# EAGLE design OSER_RFID_RFIDHub (EAGLE 9.4.2)
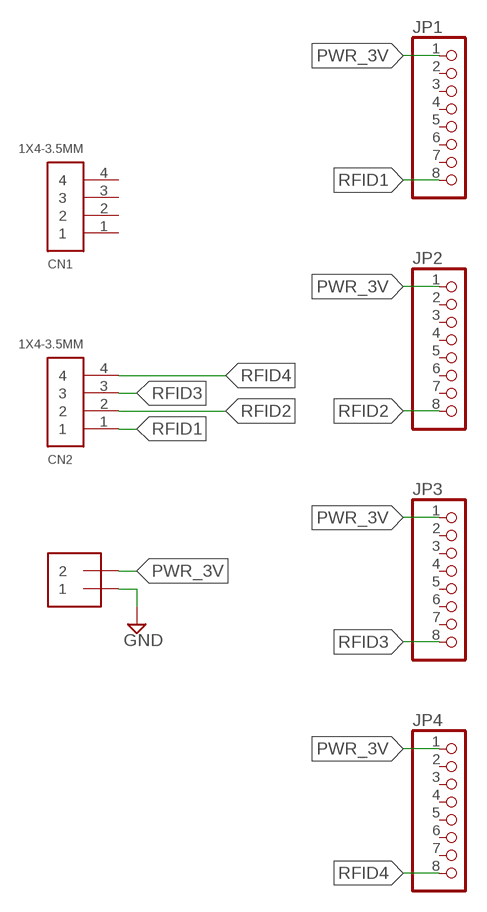
[diagram p0: schematic, sheet 1]

## Parts
CN1  1X4-3.5MM  [1X04-3.5MM]
CN2  1X4-3.5MM  [1X04-3.5MM]
J1  1X2-3.5MM  [1X2-3.5MM]
JP1  PINHD-1X8BIG  [1X08-BIG]
JP2  PINHD-1X8BIG  [1X08-BIG]
JP3  PINHD-1X8BIG  [1X08-BIG]
JP4  PINHD-1X8BIG  [1X08-BIG]

## Nets
GND: J1.1
PWR_3V: J1.2 JP1.1 JP2.1 JP3.1 JP4.1
RFID1: CN2.1 JP1.8
RFID2: CN2.2 JP2.8
RFID3: CN2.3 JP3.8
RFID4: CN2.4 JP4.8
Unconnected: CN1.1 CN1.2 CN1.3 CN1.4 JP1.2 JP1.3 JP1.4 JP1.5 JP1.6 JP1.7 JP2.2 JP2.3 JP2.4 JP2.5 JP2.6 JP2.7 JP3.2 JP3.3 JP3.4 JP3.5 JP3.6 JP3.7 JP4.2 JP4.3 JP4.4 JP4.5 JP4.6 JP4.7

## Library data of the parts
CN1 CN2 = adafruit:1X4: 4-pin connector
J1 = adafruit:1X2: 3.5mm Terminal block http://www.ladyada.net/library/pcb/eaglelibrary.html
JP1-JP4 = adafruit:PINHD-1X8: PIN HEADER

## Board
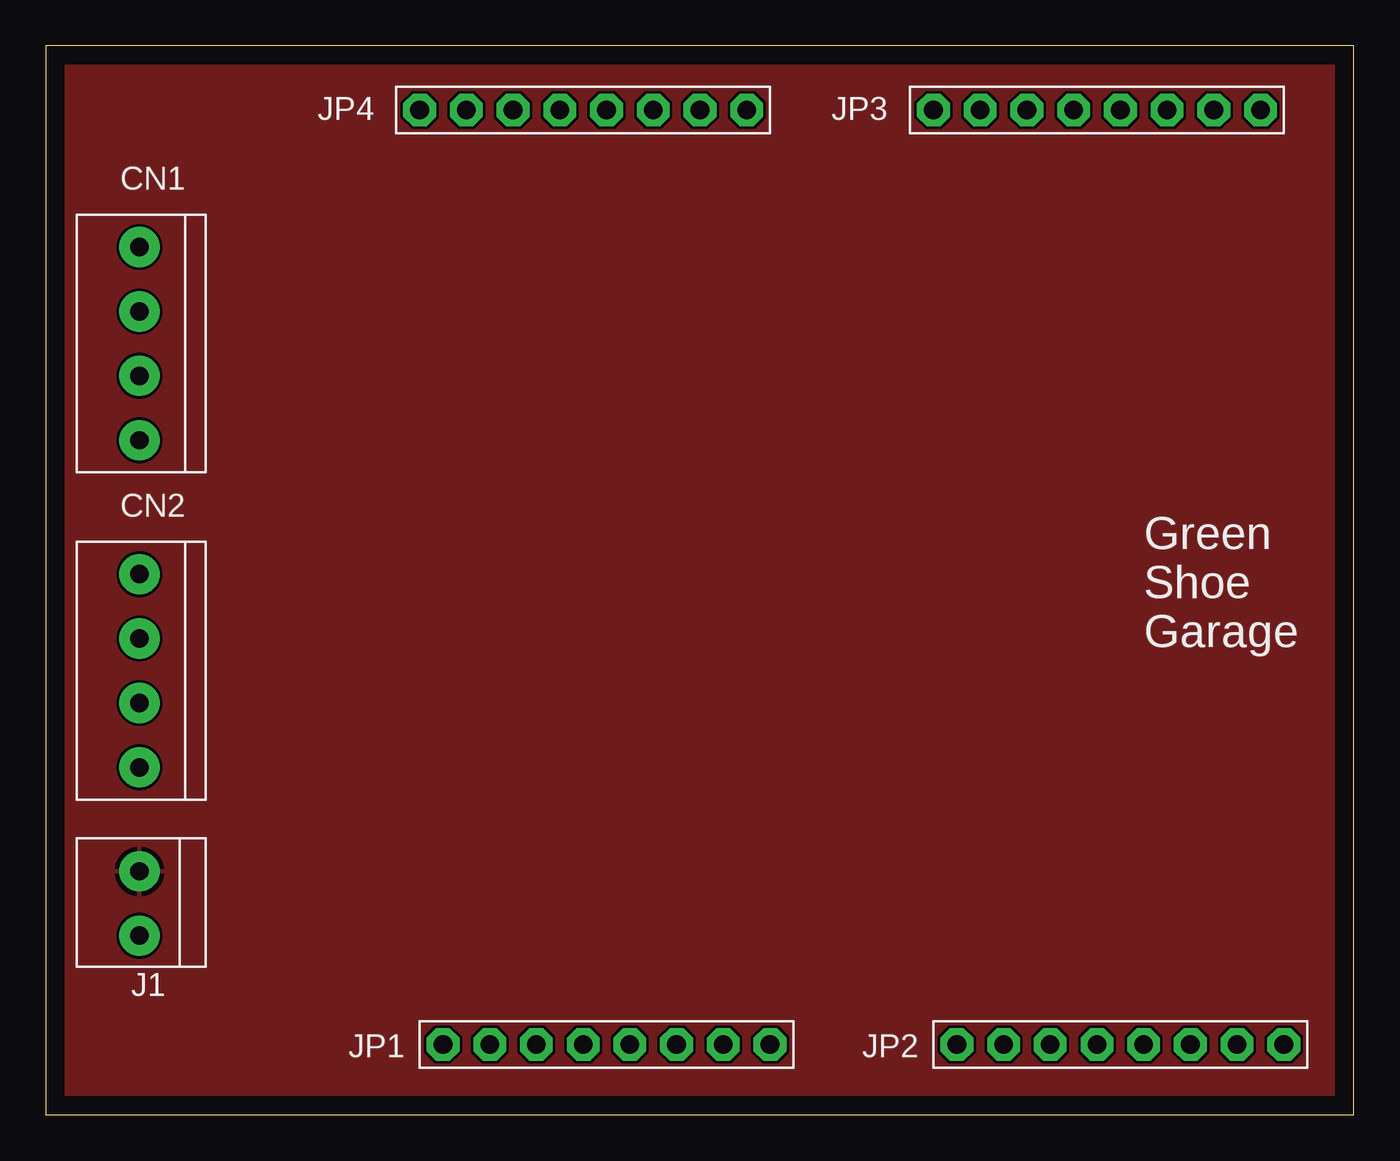
[diagram p1: board, top side]
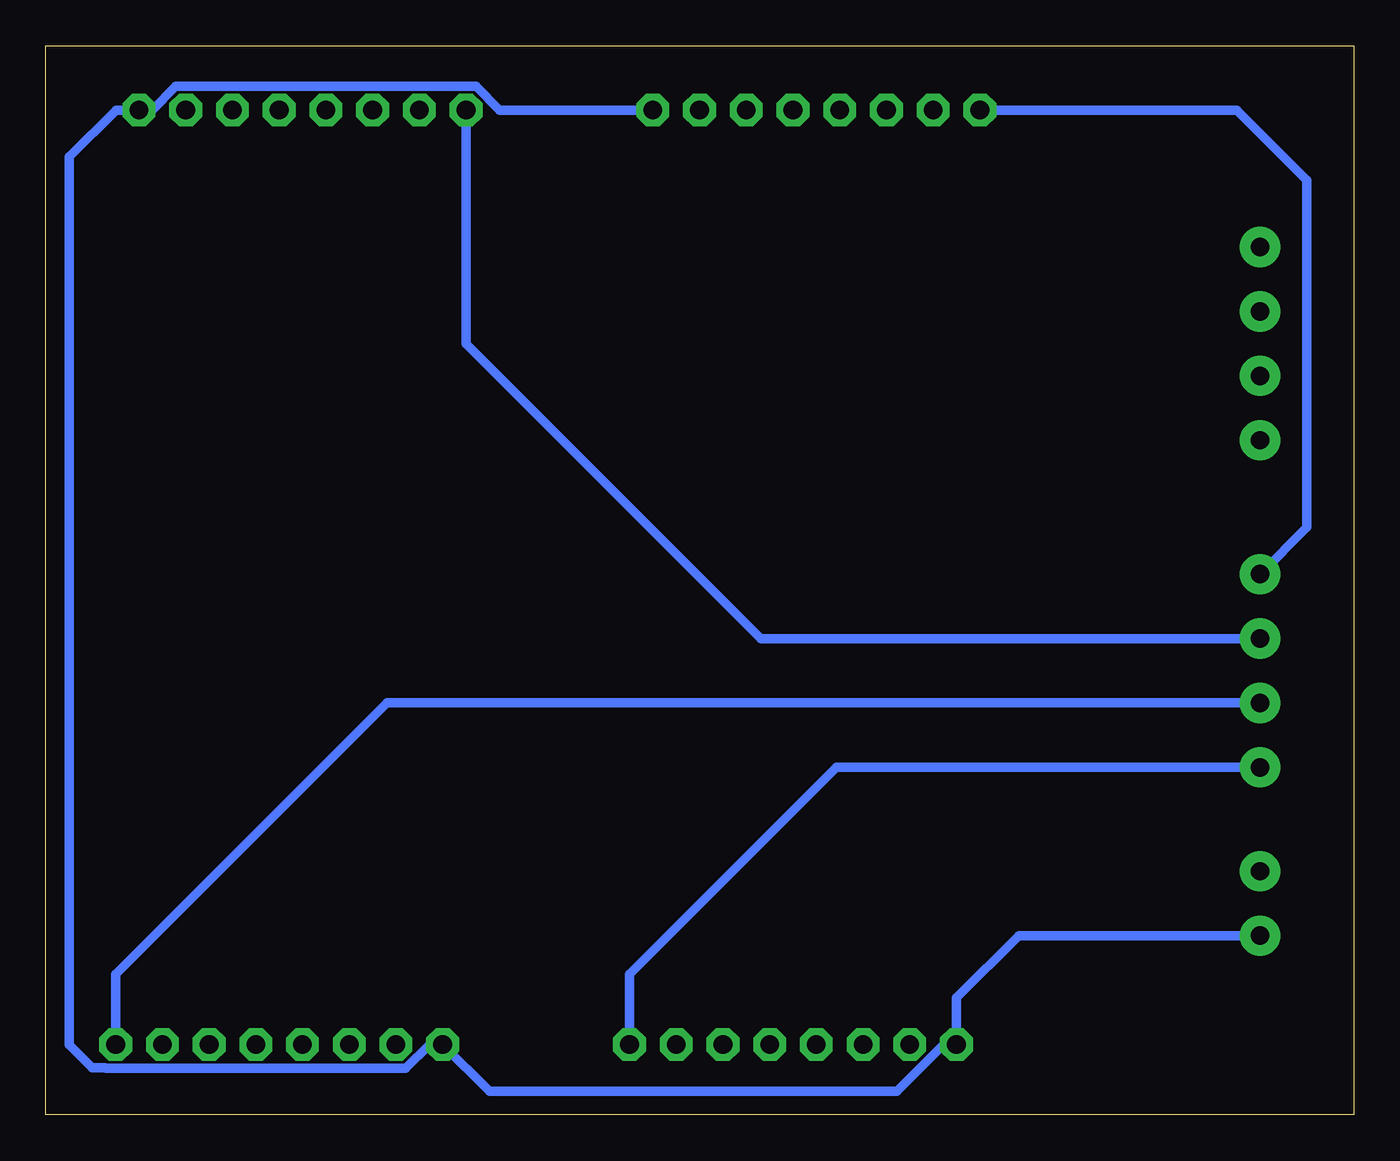
[diagram p2: board, bottom side, seen from below]

Size 71.1 x 58.09 mm. Coordinates in mm from the lower left corner, seen from the top.
Outline: 0,0 71.1,0 71.1,58.09 0,58.09 0,0
Copper layers (1*16): Top 0.035mm / dielectric 1.5mm / Bottom 0.035mm
Design rules "default": minimum track width 6mil, minimum drill 0.35mm, track to track 6mil, track to pad 6mil, pad to pad 6mil, via to via 6mil, smd to smd 6mil, copper to edge 40mil, drill to drill 6mil, minimum pad ring 10mil, minimum via ring 8mil, stop-mask expansion 4mil, vias tented up to drill 0mil, thermal gap 10mil

### Footprints (pad centres in the part's own frame; a part is rotated, then mirrored left to right if it is on the bottom)
1X04-3.5MM = drill 1 pad 2.184: 1 -5.25,0; 2 -1.75,0; 3 1.75,0; 4 5.25,0
1X2-3.5MM = drill 1 pad 2.184: 1 1.8,0; 2 -1.7,0
1X08-BIG = drill 1.016 pad 1.778 octagon: 1 -8.89,0; 2 -6.35,0; 3 -3.81,0; 4 -1.27,0; 5 1.27,0; 6 3.81,0; 7 6.35,0; 8 8.89,0

### Placement (x,y rotation side)
CN1  5.08,41.91 90 top
CN2  5.08,24.13 90 top
J1  5.08,11.43 90 top
JP1  30.48,3.81 0 top
JP2  58.42,3.81 0 top
JP3  57.15,54.61 180 top
JP4  29.21,54.61 180 top

### Tracks (layer width: path | path; a pad name or v marks a point on that pad's centre or on a via)
GND
  pour Top: -1.27,58.42 -1.27,-1.27 72.39,-1.27 72.39,58.42
PWR_3V
  Bottom 0.508: JP4.1 46.43,54.61 47.72,55.91 64.04,55.91 65.33,54.61 JP3.1 67.29,54.61 69.83,52.07 69.83,3.79 68.58,2.54 67.87,2.54 67.85,2.52 51.53,2.52 50.24,3.81 JP2.1 46.99,1.27 24.84,1.27 22.3,3.81 JP1.1 21.59,6.35 18.21,9.73 J1.2
RFID1
  Bottom 0.508: CN2.1 28.11,18.88 39.37,7.62 JP1.8
RFID2
  Bottom 0.508: CN2.2 52.55,22.38 67.31,7.62 JP2.8
RFID3
  Bottom 0.508: CN2.3 32.23,25.88 48.26,41.91 JP3.8
RFID4
  Bottom 0.508: JP4.8 6.35,54.61 2.54,50.8 2.54,31.92 CN2.4

### Text on the board
tPlace: Green / Shoe / Garage